# Altium schematic sheet Sheet2.SchDoc
size A3; SheetNumber: 1; SheetTotal: 1
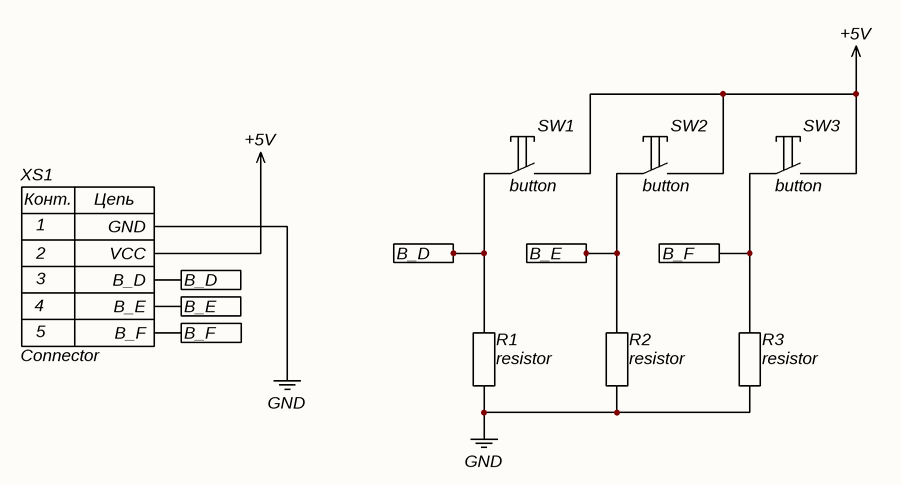
[diagram p0: Sheet2.SchDoc]

## Parts
R1  resistor  [Resistor]
R2  resistor  [Resistor]
R3  resistor  [Resistor]
SW1  button  [button]
SW2  button  [button]
SW3  button  [button]
XS1  Connector  [ConnectionModule]

## Ports
B_D (see Sheet2[2A]), B_D (see Sheet2[3A]), B_E (see Sheet2[2A]), B_E (see Sheet2[3A]), B_F (see Sheet2[2B]), B_F (see Sheet2[4A])

## Nets
+5V: SW1.2 SW2.2 SW3.2 XS1.2(VCC)
GND: R1.1 R2.1 R3.1 XS1.1(GND)
B_D: R1.2 SW1.1 XS1.3(B_D) ; port B_D
B_E: R2.2 SW2.1 XS1.4(B_E) ; port B_E
B_F: R3.2 SW3.1 XS1.5(B_F) ; port B_F

## Notes on the sheet
- (in symbol ConnectionModule) Конт.; Цепь

## Library data of the parts
XS1 = ConnectionModule: System: Connector